# Altium project VCU.PrjPcb (part 3 of 4)

## Sheet 12V_Load_Switches.SchDoc: Title
size A3; Project: Q24 VCU; ENG_APP_DATE: --/--/--; DSN_APP_DATE: --/--/--; CHK_APP_DATE: --/--/--; Date: *******; ApprovedBy: *******; CheckedBy: None; Author: *******; CompanyName: *******; DrawnBy: Jacob Chisholm; Engineer: *******; Organization: *******; Address1: *******; Address2: *******; Address3: *******; Address4: *******; DocumentNumber: 8; Revision: *******; SheetNumber: 8; SheetTotal: 14; Address_Website: https://jchisholm204.github.io; E-Mail: JacobChisholm1010@gmail.com; CurrentTime: *******; CurrentDate: *******; Time: *******; DocumentFullPathAndName: *******; DocumentName: *******; ModifiedDate: *******; ImagePath: *******; ProjectName: *******; Application_BuildNumber: *******
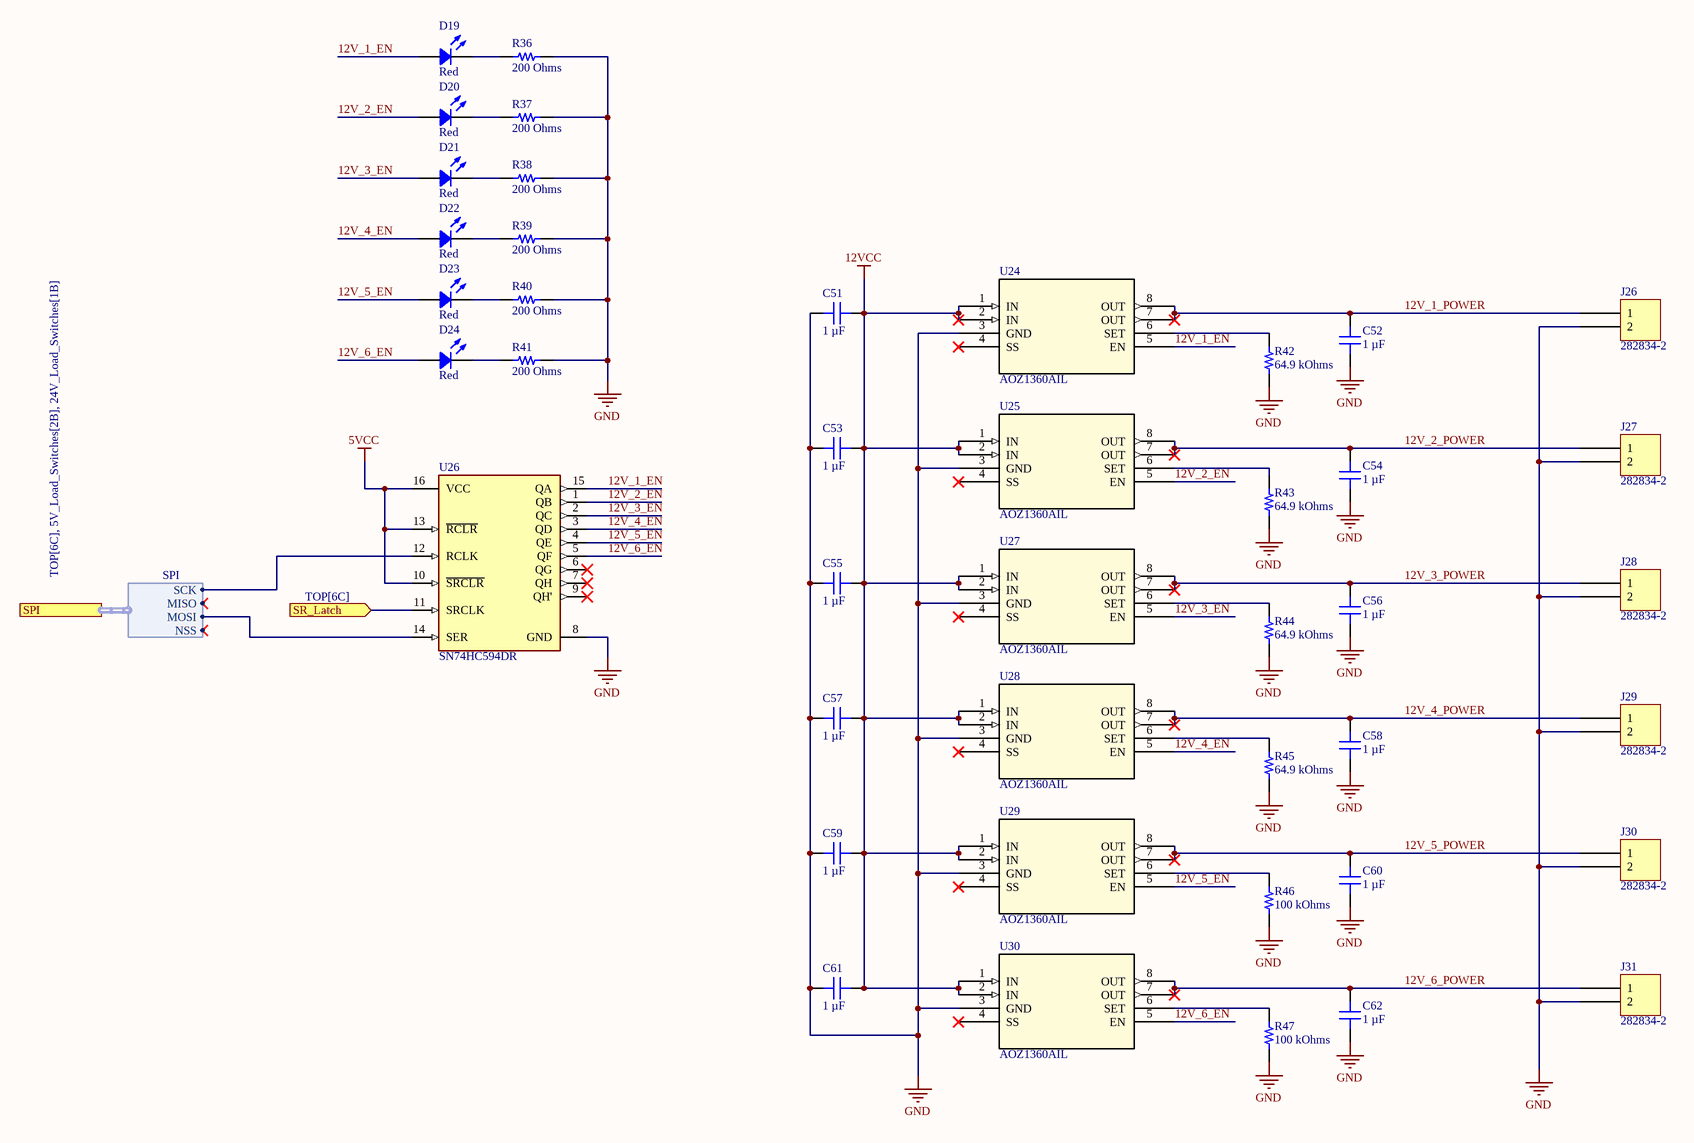
[diagram p8: 12V_Load_Switches.SchDoc]

### Parts
C51  1 µF  [CAP 0805_2012]
C52  1 µF  [CAP 0805_2012]
C53  1 µF  [CAP 0805_2012]
C54  1 µF  [CAP 0805_2012]
C55  1 µF  [CAP 0805_2012]
C56  1 µF  [CAP 0805_2012]
C57  1 µF  [CAP 0805_2012]
C58  1 µF  [CAP 0805_2012]
C59  1 µF  [CAP 0805_2012]
C60  1 µF  [CAP 0805_2012]
C61  1 µF  [CAP 0805_2012]
C62  1 µF  [CAP 0805_2012]
D19  Red  [LED 0603_1608 RED]
D20  Red  [LED 0603_1608 RED]
D21  Red  [LED 0603_1608 RED]
D22  Red  [LED 0603_1608 RED]
D23  Red  [LED 0603_1608 RED]
D24  Red  [LED 0603_1608 RED]
J26  282834-2  [TE 282834-2]
J27  282834-2  [TE 282834-2]
J28  282834-2  [TE 282834-2]
J29  282834-2  [TE 282834-2]
J30  282834-2  [TE 282834-2]
J31  282834-2  [TE 282834-2]
R36  200 Ohms  [RES 0603_1608]
R37  200 Ohms  [RES 0603_1608]
R38  200 Ohms  [RES 0603_1608]
R39  200 Ohms  [RES 0603_1608]
R40  200 Ohms  [RES 0603_1608]
R41  200 Ohms  [RES 0603_1608]
R42  64.9 kOhms  [RES 0603_1608]
R43  64.9 kOhms  [RES 0603_1608]
R44  64.9 kOhms  [RES 0603_1608]
R45  64.9 kOhms  [RES 0603_1608]
R46  100 kOhms  [RES 0603_1608]
R47  100 kOhms  [RES 0603_1608]
U24  AOZ1360AIL  [AOZ1360AIL_AOS]
U25  AOZ1360AIL  [AOZ1360AIL_AOS]
U26  SN74HC594DR  [FP-D0016A-IPC_A]
U27  AOZ1360AIL  [AOZ1360AIL_AOS]
U28  AOZ1360AIL  [AOZ1360AIL_AOS]
U29  AOZ1360AIL  [AOZ1360AIL_AOS]
U30  AOZ1360AIL  [AOZ1360AIL_AOS]

### Ports
SPI (harness SPI, see TOP[6C], 5V_Load_Switches[2B], 24V_Load_Switches[1B]), SR_Latch (in, see TOP[6C])

### Harnesses
SPI: NSS, SCK, MISO, MOSI

### Nets
5VCC: U26.10(~{SRCLR}) U26.13(~{RCLR}) U26.16(VCC)
12VCC: C51.1 C53.1 C55.1 C57.1 C59.1 C61.1 U24.1(IN) U24.2(IN) U25.1(IN) U25.2(IN) U27.1(IN) U27.2(IN) U28.1(IN) U28.2(IN) U29.1(IN) U29.2(IN) U30.1(IN) U30.2(IN)
GND: C51.2 C52.1 C53.2 C54.1 C55.2 C56.1 C57.2 C58.1 C59.2 C60.1 C61.2 C62.1 J26.2 J27.2 J28.2 J29.2 J30.2 J31.2 R36.2 R37.2 R38.2 R39.2 R40.2 R41.2 R42.1 R43.1 R44.1 R45.1 R46.1 R47.1 U24.3(GND) U25.3(GND) U26.8(GND) U27.3(GND) U28.3(GND) U29.3(GND) U30.3(GND)
12V_1_EN: D19.1 U24.5(EN) U26.15(QA)
12V_1_POWER: C52.2 J26.1 U24.7(OUT) U24.8(OUT)
12V_2_EN: D20.1 U25.5(EN) U26.1(QB)
12V_2_POWER: C54.2 J27.1 U25.7(OUT) U25.8(OUT)
12V_3_EN: D21.1 U26.2(QC) U27.5(EN)
12V_3_POWER: C56.2 J28.1 U27.7(OUT) U27.8(OUT)
12V_4_EN: D22.1 U26.3(QD) U28.5(EN)
12V_4_POWER: C58.2 J29.1 U28.7(OUT) U28.8(OUT)
12V_5_EN: D23.1 U26.4(QE) U29.5(EN)
12V_5_POWER: C60.2 J30.1 U29.7(OUT) U29.8(OUT)
12V_6_EN: D24.1 U26.5(QF) U30.5(EN)
12V_6_POWER: C62.2 J31.1 U30.7(OUT) U30.8(OUT)
SPI2_MOSI: U26.14(SER) ; port SPI.MOSI
SPI2_SCK: U26.12(RCLK) ; port SPI.SCK
SR_Latch_12V_LS: U26.11(SRCLK) ; port SR_Latch
NetD19_2: D19.2 R36.1
NetD20_2: D20.2 R37.1
NetD21_2: D21.2 R38.1
NetD22_2: D22.2 R39.1
NetD23_2: D23.2 R40.1
NetD24_2: D24.2 R41.1
NetR42_2: R42.2 U24.6(SET)
NetR43_2: R43.2 U25.6(SET)
NetR44_2: R44.2 U27.6(SET)
NetR45_2: R45.2 U28.6(SET)
NetR46_2: R46.2 U29.6(SET)
NetR47_2: R47.2 U30.6(SET)

Not connected (* = marked no-connect by the designer): U24 4(SS)*; U25 4(SS)*; U26 6(QG)* 7(QH)* 9(QH')*; U27 4(SS)*; U28 4(SS)*; U29 4(SS)*; U30 4(SS)*

### Notes on the sheet
- Title:
- Drawn By:
- Page Contents:
- Checked By:
- Size:
- Date:
- File:
- License:
- Email:
- A3
- Number:
- Time:
- Revision:
- Sheet
- Website:
- of

### Library data of the parts
C51-C62 = GCJ21BR71H105KA01L: as C17 on sheet 24V_Load_Switches; Part Number: GCJ21BR71H105KA01L; Value: 1 µF; Applications: Automotive, Boardflex Sensitive; Capacitance: 1 µF; componentlink1description: Datasheet; componentlink1url: https://www.murata.com/~/media/webrenewal/support/library/catalog/products/capacitor/mlcc/c03e.ashx?la=en-us; componentlink2description: DigiKey Link; componentlink2url: https://www.digikey.com/en/products/detail/murata-electronics/GCJ21BR71H105KA01L/4903512; Device Package: 0805 (2012 Metric); Features: Soft Termination; lastupdated: 12/20/2023 8:14:07 PM; Lifecycle Status: Active; Minimum Order: 1; Mounting Type: Surface Mount, MLCC; Operating Temperature: -55°C ~ 125°C; Package / Case: 0805 (2012 Metric); packaging: TapeAndReel; partid: 2709; Part Status: Active; price: 0.05; Ratings: AEC-Q200; series: GCJ; Size / Dimension: 0.079" L x 0.049" W (2.00mm x 1.25mm); Supplier 1: DigiKey; Supplier Part Number 1: 490-10667-1-ND; Temperature Coefficient: X7R; Thickness (Max): 0.057" (1.45mm); Voltage - Rated: 50V
D19-D24 = 19-213SDRC/S259/TR8: as D1 on sheet 24V_Load_Switches; Part Number: 19-213SDRC/S259/TR8; Color: Red; ComponentLink1Description: Datasheet; ComponentLink1URL: //media.digikey.com/pdf/Data%20Sheets/Everlight%20PDFs/19-213SDRC-S259-TR8.pdf; ComponentLink2Description: DigiKey Link; ComponentLink2URL: http://digikey.com/product-detail/en/everlight-electronics-co-ltd/19-213SDRC-S259-TR8/1080-1580-1-ND/8535303; Device Package: 0603 (1608 Metric); Height (Max): 0.70mm; LastUpdated: 2/2/2024 9:29:56 PM; Lens Transparency: Clear; Lifecycle Status: Active; Minimum Order: 1; Mounting Type: Surface Mount; Package / Case: 0603 (1608 Metric); Packaging: TapeAndReel; PartId: 372; Part Status: Active; Price: 0.06; Series: -; Size / Dimension: 1.60mm L x 0.80mm W; Supplier 1: DigiKey; Supplier Part Number 1: 1080-1580-1-ND; Supplier Device Package: 2-SMD; Value: Red
J26-J31 = 282834-2: as J10 on sheet 24V_Load_Switches; Part Number: 282834-2; Color: Green; ComponentLink1Description: Datasheet; ComponentLink1URL: https://www.te.com/commerce/DocumentDelivery/DDEController?Action=srchrtrv&DocNm=282834&DocType=Customer+Drawing&DocLang=English; ComponentLink2Description: DigiKey Link; ComponentLink2URL: http://digikey.com/product-detail/en/te-connectivity-amp-connectors/282834-2/A98333-ND/1150135; LastUpdated: 1/15/2020 4:15:38 AM; Lifecycle Status: Active; Minimum Order: 1; Mounting Type: Through Hole; Packaging: Bulk; Part Status: Active; Price: 0.88; Series: Buchanan; Supplier 1: DigiKey; Supplier Part Number 1: A98333-ND
R36-R41 = RS73F1JTTD2000B: as R14 on sheet 24V_Load_Switches; Part Number: RS73F1JTTD2000B; Value: 200 Ohms; ComponentLink1Description: Datasheet; ComponentLink1URL: http://www.koaspeer.com/pdfs/RS73.pdf; ComponentLink2Description: DigiKey Link; ComponentLink2URL: https://www.digikey.com/en/products/detail/koa-speer-electronics-inc/RS73F1JTTD2000B/11594419; Composition: Thick Film; Device Package: 0603 (1608 Metric); Features: Automotive AEC-Q200, Moisture Resistant; Height - Seated (Max): 0.022" (0.55mm); LastUpdated: 2/2/2024 8:38:37 PM; Lifecycle Status: Active; Minimum Order: 1; Number of Terminations: 2; Operating Temperature: -55°C ~ 155°C; Package / Case: 0603 (1608 Metric); Packaging: TapeAndReel; PartId: 56369; Part Status: Active; Price: 0.07; Ratings: AEC-Q200; Resistance: 200 Ohms; Series: RS73; Size / Dimension: 0.063" L x 0.031" W (1.60mm x 0.80mm); Supplier 1: DigiKey; Supplier Part Number 1: 2019-RS73F1JTTD2000BCT-ND; Supplier Device Package: 0603; Tolerance: ±0.1%
R42-R45 = 7-2176089-3: RES SMD 64.9K OHM 0.1% 1/6W 0603; Manufacturer: TE Connectivity Passive Product; Power (Watts): 0.167W, 1/6W; Temperature Coefficient: ±25ppm/°C; Part Number: 7-2176089-3; Value: 64.9 kOhms; ComponentLink1Description: Datasheet; ComponentLink1URL: https://www.te.com/commerce/DocumentDelivery/DDEController?Action=srchrtrv&DocNm=1773272&DocType=DS&DocLang=English; ComponentLink2Description: DigiKey Link; ComponentLink2URL: https://www.digikey.com/en/products/detail/te-connectivity-passive-product/7-2176089-3/4033750; Composition: Thin Film; Device Package: 0603 (1608 Metric); Height - Seated (Max): 0.022" (0.55mm); LastUpdated: 12/19/2023 8:39:23 PM; Lifecycle Status: Active; Minimum Order: 1; Number of Terminations: 2; Operating Temperature: -55°C ~ 155°C; Package / Case: 0603 (1608 Metric); Packaging: TapeAndReel; PartId: 23912; Part Status: Active; Price: 0.14; Resistance: 64.9 kOhms; Series: RP73P, Holsworthy; Size / Dimension: 0.061" L x 0.031" W (1.55mm x 0.80mm); Supplier 1: DigiKey; Supplier Part Number 1: A110282CT-ND; Supplier Device Package: 0603; Tolerance: ±0.1%
R46 R47 = AA0603FR-07100KL: RES SMD 100K OHM 1% 1/10W 0603; Manufacturer: Yageo; Power (Watts): 0.1W, 1/10W; Temperature Coefficient: ±150ppm/°C; Part Number: AA0603FR-07100KL; Value: 100 kOhms; ComponentLink1Description: Datasheet; ComponentLink1URL: https://www.yageo.com/upload/media/product/productsearch/datasheet/rchip/PYu-AA_51_RoHS_L_3.pdf; ComponentLink2Description: DigiKey Link; ComponentLink2URL: https://www.digikey.com/en/products/detail/yageo/AA0603FR-07100KL/5888687; Composition: Thick Film; Device Package: 0603 (1608 Metric); Features: Anti-Sulfur, Automotive AEC-Q200, Moisture Resistant; Height - Seated (Max): 0.022" (0.55mm); LastUpdated: 12/20/2023 8:36:28 PM; Lifecycle Status: Active; Minimum Order: 1; Number of Terminations: 2; Operating Temperature: -55°C ~ 155°C; Package / Case: 0603 (1608 Metric); Packaging: TapeAndReel; PartId: 78895; Price: 0.01; Ratings: AEC-Q200; Resistance: 100 kOhms; Series: AA; Size / Dimension: 0.063" L x 0.031" W (1.60mm x 0.80mm); Supplier 1: DigiKey; Supplier Part Number 1: 13-AA0603FR-07100KLCT-ND; Supplier Device Package: 0603; Tolerance: ±1%
U24 U25 U27-U30 = AOZ1360AIL: No Description Available; Mfr_Name: Alpha and Omega Semiconductor; Copyright: Copyright (C) 2023 Ultra Librarian. All rights reserved.; Manufacturer_Part_Number: AOZ1360AIL; RefDes: RefDes; Type: DEV
U26 = CMP-0780-00061-4: as U6 on sheet 24V_Load_Switches; RoHS Compliant: Yes; Width: 3.91mm; Length: 9.9mm; Min Operating Temperature: -40°C; Max Operating Temperature: 125°C; Package Quantity: 2500; Series: 74HC; Height: 1.58mm; Number of Bits: 8; Mount: Surface Mount; Logic Function: Shift Register; Radiation Hardening: No; Number of Pins: 16; Technology: CMOS; Packaging: Tape and Reel; Lead Free: Lead Free; Weight: 0.004998oz; REACH SVHC: No SVHC; Case/Package: SOIC

## Sheet 5V_Load_Switches.SchDoc: Title
size A3; Project: Q24 VCU; ENG_APP_DATE: --/--/--; DSN_APP_DATE: --/--/--; CHK_APP_DATE: --/--/--; Date: *******; ApprovedBy: *******; CheckedBy: None; Author: *******; CompanyName: *******; DrawnBy: Jacob Chisholm; Engineer: *******; Organization: *******; Address1: *******; Address2: *******; Address3: *******; Address4: *******; DocumentNumber: 7; Revision: *******; SheetNumber: 7; SheetTotal: 14; Address_Website: https://jchisholm204.github.io; E-Mail: JacobChisholm1010@gmail.com; CurrentTime: *******; CurrentDate: *******; Time: *******; DocumentFullPathAndName: *******; DocumentName: *******; ModifiedDate: *******; ImagePath: *******; ProjectName: *******; Application_BuildNumber: *******
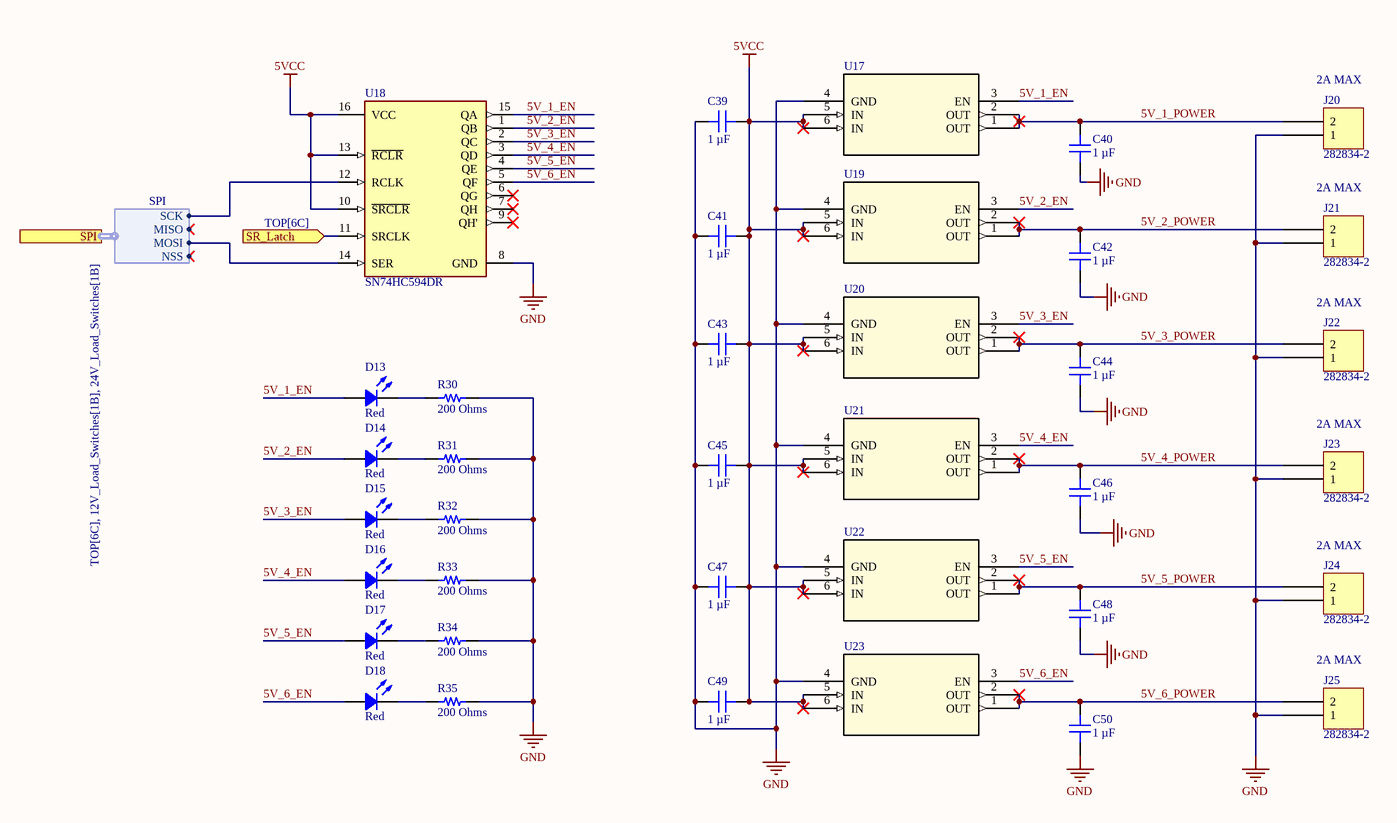
[diagram p9: 5V_Load_Switches.SchDoc]

### Parts
C39  1 µF  [CAP 0805_2012]
C40  1 µF  [CAP 0805_2012]
C41  1 µF  [CAP 0805_2012]
C42  1 µF  [CAP 0805_2012]
C43  1 µF  [CAP 0805_2012]
C44  1 µF  [CAP 0805_2012]
C45  1 µF  [CAP 0805_2012]
C46  1 µF  [CAP 0805_2012]
C47  1 µF  [CAP 0805_2012]
C48  1 µF  [CAP 0805_2012]
C49  1 µF  [CAP 0805_2012]
C50  1 µF  [CAP 0805_2012]
D13  Red  [LED 0603_1608 RED]
D14  Red  [LED 0603_1608 RED]
D15  Red  [LED 0603_1608 RED]
D16  Red  [LED 0603_1608 RED]
D17  Red  [LED 0603_1608 RED]
D18  Red  [LED 0603_1608 RED]
J20  282834-2  [TE 282834-2]
J21  282834-2  [TE 282834-2]
J22  282834-2  [TE 282834-2]
J23  282834-2  [TE 282834-2]
J24  282834-2  [TE 282834-2]
J25  282834-2  [TE 282834-2]
R30  200 Ohms  [RES 0603_1608]
R31  200 Ohms  [RES 0603_1608]
R32  200 Ohms  [RES 0603_1608]
R33  200 Ohms  [RES 0603_1608]
R34  200 Ohms  [RES 0603_1608]
R35  200 Ohms  [RES 0603_1608]
U17  (no value)  [SIP32510DT-T1-GE3_VIS]
U18  SN74HC594DR  [FP-D0016A-IPC_A]
U19  (no value)  [SIP32510DT-T1-GE3_VIS]
U20  (no value)  [SIP32510DT-T1-GE3_VIS]
U21  (no value)  [SIP32510DT-T1-GE3_VIS]
U22  (no value)  [SIP32510DT-T1-GE3_VIS]
U23  (no value)  [SIP32510DT-T1-GE3_VIS]

### Ports
SPI (harness SPI, see TOP[6C], 12V_Load_Switches[1B], 24V_Load_Switches[1B]), SR_Latch (in, see TOP[6C])

### Harnesses
SPI: NSS, SCK, MISO, MOSI

### Nets
5VCC: C39.2 C41.2 C43.2 C45.2 C47.2 C49.2 U17.5(IN) U17.6(IN) U18.10(~{SRCLR}) U18.13(~{RCLR}) U18.16(VCC) U19.5(IN) U19.6(IN) U20.5(IN) U20.6(IN) U21.5(IN) U21.6(IN) U22.5(IN) U22.6(IN) U23.5(IN) U23.6(IN)
GND: C39.1 C40.1 C41.1 C42.1 C43.1 C44.1 C45.1 C46.1 C47.1 C48.1 C49.1 C50.1 J20.1 J21.1 J22.1 J23.1 J24.1 J25.1 R30.2 R31.2 R32.2 R33.2 R34.2 R35.2 U17.4(GND) U18.8(GND) U19.4(GND) U20.4(GND) U21.4(GND) U22.4(GND) U23.4(GND)
5V_1_EN: D13.1 U17.3(EN) U18.15(QA)
5V_1_POWER: C40.2 J20.2 U17.1(OUT) U17.2(OUT)
5V_2_EN: D14.1 U18.1(QB) U19.3(EN)
5V_2_POWER: C42.2 J21.2 U19.1(OUT) U19.2(OUT)
5V_3_EN: D15.1 U18.2(QC) U20.3(EN)
5V_3_POWER: C44.2 J22.2 U20.1(OUT) U20.2(OUT)
5V_4_EN: D16.1 U18.3(QD) U21.3(EN)
5V_4_POWER: C46.2 J23.2 U21.1(OUT) U21.2(OUT)
5V_5_EN: D17.1 U18.4(QE) U22.3(EN)
5V_5_POWER: C48.2 J24.2 U22.1(OUT) U22.2(OUT)
5V_6_EN: D18.1 U18.5(QF) U23.3(EN)
5V_6_POWER: C50.2 J25.2 U23.1(OUT) U23.2(OUT)
SPI2_MOSI: U18.14(SER) ; port SPI.MOSI
SPI2_SCK: U18.12(RCLK) ; port SPI.SCK
SR_Latch_5V_LS: U18.11(SRCLK) ; port SR_Latch
NetD13_2: D13.2 R30.1
NetD14_2: D14.2 R31.1
NetD15_2: D15.2 R32.1
NetD16_2: D16.2 R33.1
NetD17_2: D17.2 R34.1
NetD18_2: D18.2 R35.1

Not connected (* = marked no-connect by the designer): U18 6(QG)* 7(QH)* 9(QH')*

### Notes on the sheet
- (near J20) 2A MAX
- 2A MAX
- (near J23) 2A MAX
- (near J24) 2A MAX
- Title:
- Drawn By:
- Page Contents:
- Checked By:
- Size:
- Date:
- File:
- License:
- Email:
- A3
- Number:
- Time:
- Revision:
- Sheet
- Website:
- of

### Library data of the parts
C39-C48 C50 = 0805B105K500CT: CAP CER 1UF 50V X7R 0805; manufacturer: Walsin Technology Corporation; Tolerance: ±10%; Part Number: 0805B105K500CT; Value: 1 µF; Applications: General Purpose; Capacitance: 1 µF; componentlink1description: Datasheet; componentlink1url: https://www.passivecomponent.com/wp-content/uploads/datasheet/WTC_MLCC_General_Purpose.pdf; componentlink2description: DigiKey Link; componentlink2url: https://www.digikey.com/en/products/detail/walsin-technology-corporation/0805B105K500CT/14836864; Device Package: 0805 (2012 Metric); lastupdated: 12/20/2023 8:12:21 PM; Lifecycle Status: Active; Minimum Order: 1; Mounting Type: Surface Mount, MLCC; Operating Temperature: -55°C ~ 125°C; Package / Case: 0805 (2012 Metric); packaging: TapeAndReel; partid: 41252; Part Status: Active; price: 0.05; series: -; Size / Dimension: 0.079" L x 0.049" W (2.00mm x 1.25mm); Supplier 1: DigiKey; Supplier Part Number 1: 1292-0805B105K500CT-ND; Temperature Coefficient: X7R; Thickness (Max): 0.057" (1.45mm); Voltage - Rated: 50V
C49 = 08051Z105KAT2A: 0805 X7S 1UF10% 100V; manufacturer: KYOCERA AVX; Tolerance: ±10%; Part Number: 08051Z105KAT2A; Value: 1 µF; Applications: General Purpose; Capacitance: 1 µF; componentlink1description: Datasheet; componentlink1url: https://datasheets.kyocera-avx.com/X7S.pdf; componentlink2description: DigiKey Link; componentlink2url: https://www.digikey.com/en/products/detail/kyocera-avx/08051Z105KAT2A/17866368; Device Package: 0805 (2012 Metric); lastupdated: 2/1/2024 8:13:20 PM; Lifecycle Status: Active; Minimum Order: 1; Mounting Type: Surface Mount, MLCC; Operating Temperature: -55°C ~ 125°C; Package / Case: 0805 (2012 Metric); packaging: TapeAndReel; partid: 54857; Part Status: Active; price: 0.08; series: -; Size / Dimension: 0.079" L x 0.049" W (2.01mm x 1.25mm); Supplier 1: DigiKey; Supplier Part Number 1: 478-08051Z105KAT2ACT-ND; Temperature Coefficient: X7S; Voltage - Rated: 100V
D13-D18 = 19-213SDRC/S259/TR8: LED RED CLEAR 2SMD; Manufacturer: Everlight Electronics Co Ltd; Configuration: Standard; Current - Test: 10mA; Lens Color: Colorless; Lens Size: 1.20mm x 0.80mm; Lens Style: Rectangle with Flat Top; Viewing Angle: 120°; Voltage - Forward (Vf) (Typ): 2V; Wavelength - Peak: 650nm; Part Number: 19-213SDRC/S259/TR8; Color: Red; ComponentLink1Description: Datasheet; ComponentLink1URL: //media.digikey.com/pdf/Data%20Sheets/Everlight%20PDFs/19-213SDRC-S259-TR8.pdf; ComponentLink2Description: DigiKey Link; ComponentLink2URL: http://digikey.com/product-detail/en/everlight-electronics-co-ltd/19-213SDRC-S259-TR8/1080-1580-1-ND/8535303; Device Package: 0603 (1608 Metric); Height (Max): 0.70mm; LastUpdated: 2/2/2024 9:29:56 PM; Lens Transparency: Clear; Lifecycle Status: Active; Minimum Order: 1; Mounting Type: Surface Mount; Package / Case: 0603 (1608 Metric); Packaging: TapeAndReel; PartId: 372; Part Status: Active; Price: 0.06; Series: -; Size / Dimension: 1.60mm L x 0.80mm W; Supplier 1: DigiKey; Supplier Part Number 1: 1080-1580-1-ND; Supplier Device Package: 2-SMD; Value: Red
J20-J25 = 282834-2: TERM BLK 2P SIDE ENT 2.54MM PCB; Manufacturer: TE Connectivity AMP Connectors; Current: 10A; Mating Orientation: Horizontal with Board; Number of Levels: 1; Pitch: 0.100" (2.54mm); Positions Per Level: 2; Voltage: 150V; Wire Gauge: 16-30 AWG; Wire Termination: Screw - Rising Cage Clamp; Part Number: 282834-2; Color: Green; ComponentLink1Description: Datasheet; ComponentLink1URL: https://www.te.com/commerce/DocumentDelivery/DDEController?Action=srchrtrv&DocNm=282834&DocType=Customer+Drawing&DocLang=English; ComponentLink2Description: DigiKey Link; ComponentLink2URL: http://digikey.com/product-detail/en/te-connectivity-amp-connectors/282834-2/A98333-ND/1150135; LastUpdated: 1/15/2020 4:15:38 AM; Lifecycle Status: Active; Minimum Order: 1; Mounting Type: Through Hole; Packaging: Bulk; Part Status: Active; Price: 0.88; Series: Buchanan; Supplier 1: DigiKey; Supplier Part Number 1: A98333-ND
R30-R35 = RS73F1JTTD2000B: RES 200 OHM 0.1% 1/5W 0603; Manufacturer: KOA Speer Electronics, Inc.; Power (Watts): 0.2W, 1/5W; Temperature Coefficient: ±25ppm/°C; Part Number: RS73F1JTTD2000B; Value: 200 Ohms; ComponentLink1Description: Datasheet; ComponentLink1URL: http://www.koaspeer.com/pdfs/RS73.pdf; ComponentLink2Description: DigiKey Link; ComponentLink2URL: https://www.digikey.com/en/products/detail/koa-speer-electronics-inc/RS73F1JTTD2000B/11594419; Composition: Thick Film; Device Package: 0603 (1608 Metric); Features: Automotive AEC-Q200, Moisture Resistant; Height - Seated (Max): 0.022" (0.55mm); LastUpdated: 2/2/2024 8:38:37 PM; Lifecycle Status: Active; Minimum Order: 1; Number of Terminations: 2; Operating Temperature: -55°C ~ 155°C; Package / Case: 0603 (1608 Metric); Packaging: TapeAndReel; PartId: 56369; Part Status: Active; Price: 0.07; Ratings: AEC-Q200; Resistance: 200 Ohms; Series: RS73; Size / Dimension: 0.063" L x 0.031" W (1.60mm x 0.80mm); Supplier 1: DigiKey; Supplier Part Number 1: 2019-RS73F1JTTD2000BCT-ND; Supplier Device Package: 0603; Tolerance: ±0.1%
U17 U19-U23 = SIP32510DT-T1-GE3: No Description Available; Mfr_Name: Vishay; Copyright: Copyright (C) 2023 Ultra Librarian. All rights reserved.; Manufacturer_Part_Number: SIP32510DT-T1-GE3; RefDes: RefDes; Type: DEV
U18 = CMP-0780-00061-4: IC SHIFT REGISTER 8BIT 16-SOIC; Number of Bits per Element: 8; Min Supply Voltage: 2V; Frequency: 40MHz; Max Supply Voltage: 6V; Operating Supply Voltage: 5V; Number of Output Lines: 10; Propagation Delay: 25ns; Number of Elements: 1; Number of Circuits: 4; Direction: Unidirectional; Turn-On Delay Time: 185ns; RoHS Compliant: Yes; Width: 3.91mm; Length: 9.9mm; Min Operating Temperature: -40°C; Max Operating Temperature: 125°C; Package Quantity: 2500; Series: 74HC; Height: 1.58mm; Number of Bits: 8; Mount: Surface Mount; Logic Function: Shift Register; Radiation Hardening: No; Number of Pins: 16; Technology: CMOS; Packaging: Tape and Reel; Lead Free: Lead Free; Weight: 0.004998oz; REACH SVHC: No SVHC; Case/Package: SOIC

## Sheet 24V_FETS.SchDoc: Title
size A4; Project: Q24 VCU; ENG_APP_DATE: --/--/--; DSN_APP_DATE: --/--/--; CHK_APP_DATE: --/--/--; Date: *******; ApprovedBy: *******; CheckedBy: None; Author: *******; CompanyName: *******; DrawnBy: Jacob Chisholm; Engineer: *******; Organization: *******; Address1: *******; Address2: *******; Address3: *******; Address4: *******; DocumentNumber: 6; Revision: *******; SheetNumber: 6; SheetTotal: 14; Address_Website: https://jchisholm204.github.io; E-Mail: JacobChisholm1010@gmail.com; CurrentTime: *******; CurrentDate: *******; Time: *******; DocumentFullPathAndName: *******; DocumentName: *******; ModifiedDate: *******; ImagePath: *******; ProjectName: *******; Application_BuildNumber: *******
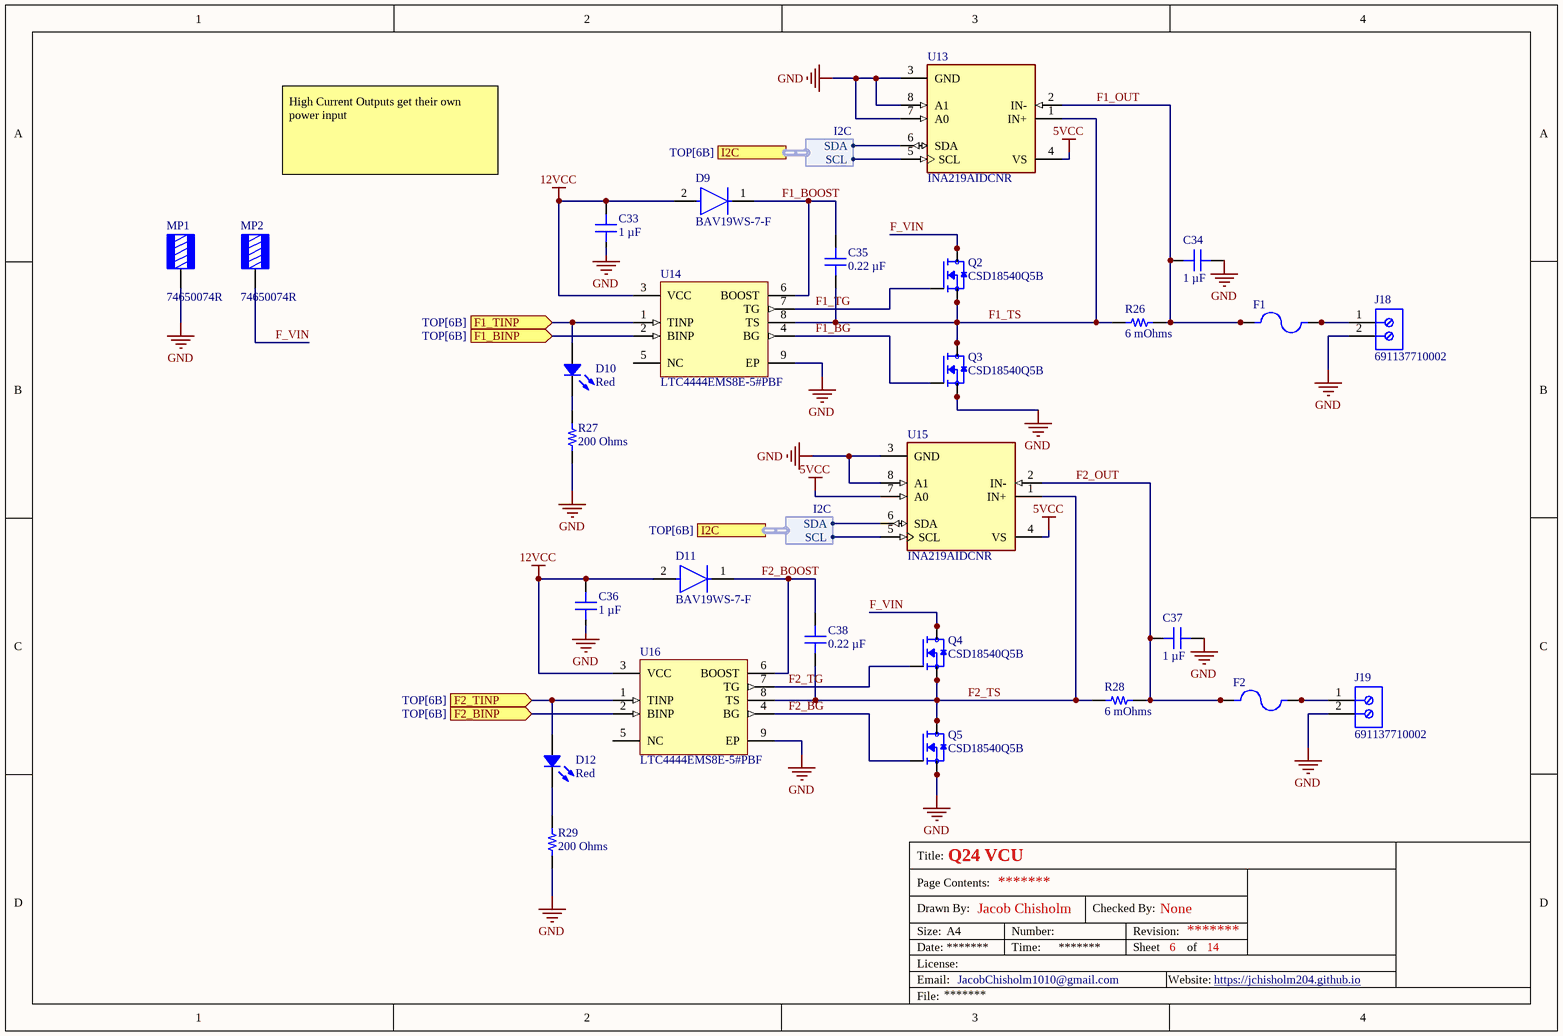
[diagram p10: 24V_FETS.SchDoc]

### Parts
C33  1 µF  [CAP 0603_1608]
C34  1 µF  [CAP 0805_2012]
C35  0.22 µF  [CAP 0603_1608]
C36  1 µF  [CAP 0603_1608]
C37  1 µF  [CAP 0805_2012]
C38  0.22 µF  [CAP 0603_1608]
D9  BAV19WS-7-F  [FP-SOD323-MFG]
D10  Red  [LED 0603_1608 RED]
D11  BAV19WS-7-F  [FP-SOD323-MFG]
D12  Red  [LED 0603_1608 RED]
F1  (no value)  [FUSE_3587-10TR]
F2  (no value)  [FUSE_3587-10TR]
J18  691137710002  [691137710002]
J19  691137710002  [691137710002]
MP1  74650074R  [WURTH 74650074]
MP2  74650074R  [WURTH 74650074]
Q2  CSD18540Q5B  [TRANS_CSD18540Q5B]
Q3  CSD18540Q5B  [TRANS_CSD18540Q5B]
Q4  CSD18540Q5B  [TRANS_CSD18540Q5B]
Q5  CSD18540Q5B  [TRANS_CSD18540Q5B]
R26  6 mOhms  [RES 0805_2012]
R27  200 Ohms  [RES 0603_1608]
R28  6 mOhms  [RES 0805_2012]
R29  200 Ohms  [RES 0603_1608]
U13  INA219AIDCNR  [FP-DCN0008A-IPC_B]
U14  LTC4444EMS8E-5#PBF  [LT-MS8E-8-EDP_L]
U15  INA219AIDCNR  [FP-DCN0008A-IPC_B]
U16  LTC4444EMS8E-5#PBF  [LT-MS8E-8-EDP_L]

### Ports
F1_BINP (in, see TOP[6B]), F1_TINP (in, see TOP[6B]), F2_BINP (in, see TOP[6B]), F2_TINP (in, see TOP[6B]), I2C (harness I2C, see TOP[6B])

### Harnesses
I2C: SDA, SCL

### Nets
5VCC: U13.4(VS) U15.4(VS) U15.7(A0)
12VCC: C33.2 C36.2 D9.2(A) D11.2(A) U14.3(VCC) U16.3(VCC)
GND: C33.1 C34.1 C36.1 C37.1 J18.2 J19.2 MP1.1 Q3.1(S) Q3.2(S) Q3.3(S) Q5.1(S) Q5.2(S) Q5.3(S) R27.2 R29.2 U13.3(GND) U13.7(A0) U13.8(A1) U14.9(EP) U15.3(GND) U15.8(A1) U16.9(EP)
F1_BG: Q3.4(G) U14.4(BG)
F1_BOOST: C35.2 D9.1(C) U14.6(BOOST)
F1_HIGH: D10.1 U14.1(TINP) ; port F1_TINP
F1_LOW: U14.2(BINP) ; port F1_BINP
F1_OUT: C34.2 F1.1_1 F1.1_2 R26.2 U13.2(IN-)
F1_TG: Q2.4(G) U14.7(TG)
F1_TS: C35.1 Q2.1(S) Q2.2(S) Q2.3(S) Q3.5(D) Q3.6(D) Q3.7(D) Q3.8(D) R26.1 U13.1(IN+) U14.8(TS)
F2_BG: Q5.4(G) U16.4(BG)
F2_BOOST: C38.2 D11.1(C) U16.6(BOOST)
F2_HIGH: D12.1 U16.1(TINP) ; port F2_TINP
F2_LOW: U16.2(BINP) ; port F2_BINP
F2_OUT: C37.2 F2.1_1 F2.1_2 R28.2 U15.2(IN-)
F2_TG: Q4.4(G) U16.7(TG)
F2_TS: C38.1 Q4.1(S) Q4.2(S) Q4.3(S) Q5.5(D) Q5.6(D) Q5.7(D) Q5.8(D) R28.1 U15.1(IN+) U16.8(TS)
F_VIN: MP2.1 Q2.5(D) Q2.6(D) Q2.7(D) Q2.8(D) Q4.5(D) Q4.6(D) Q4.7(D) Q4.8(D)
I2C3_SCL: U13.5(SCL) U15.5(SCL) ; port I2C.SCL
I2C3_SDA: U13.6(SDA) U15.6(SDA) ; port I2C.SDA
NetD10_2: D10.2 R27.1
NetD12_2: D12.2 R29.1
NetF1_2_1: F1.2_1 F1.2_2 J18.1
NetF2_2_1: F2.2_1 F2.2_2 J19.1

Not connected (* = marked no-connect by the designer): U14 5(NC); U16 5(NC)

### Notes on the sheet
- High Current Outputs get their own power input
- Title:
- Drawn By:
- Page Contents:
- Checked By:
- Size:
- Date:
- File:
- License:
- Email:
- A4
- Number:
- Time:
- Revision:
- Sheet
- Website:
- of

### Library data of the parts
C33 C36 = 0603DC105KAT2A: CAP CER 1UF 35V X7R 0603; manufacturer: KYOCERA AVX; Tolerance: ±10%; Part Number: 0603DC105KAT2A; Value: 1 µF; Applications: General Purpose; Capacitance: 1 µF; componentlink1description: Datasheet; componentlink1url: https://media.digikey.com/pdf/Data%20Sheets/AVX%20PDFs/0603DC105KAT2A_DS.pdf; componentlink2description: DigiKey Link; componentlink2url: https://www.digikey.com/en/products/detail/kyocera-avx/0603DC105KAT2A/11208437; Device Package: 0603 (1608 Metric); lastupdated: 2/9/2024 8:09:59 PM; Lifecycle Status: Active; Minimum Order: 1; Mounting Type: Surface Mount, MLCC; Operating Temperature: -55°C ~ 125°C; Package / Case: 0603 (1608 Metric); packaging: TapeAndReel; partid: 35801; Part Status: Active; price: 0.04; series: -; Size / Dimension: 0.063" L x 0.032" W (1.60mm x 0.81mm); Supplier 1: DigiKey; Supplier Part Number 1: 478-0603DC105KAT2ACT-ND; Temperature Coefficient: X7R; Voltage - Rated: 35V
C34 C37 = GCJ21BR71H105KA01L: CAP CER 1UF 50V X7R 0805; manufacturer: Murata Electronics; Tolerance: ±10%; Part Number: GCJ21BR71H105KA01L; Value: 1 µF; Applications: Automotive, Boardflex Sensitive; Capacitance: 1 µF; componentlink1description: Datasheet; componentlink1url: https://www.murata.com/~/media/webrenewal/support/library/catalog/products/capacitor/mlcc/c03e.ashx?la=en-us; componentlink2description: DigiKey Link; componentlink2url: https://www.digikey.com/en/products/detail/murata-electronics/GCJ21BR71H105KA01L/4903512; Device Package: 0805 (2012 Metric); Features: Soft Termination; lastupdated: 12/20/2023 8:14:07 PM; Lifecycle Status: Active; Minimum Order: 1; Mounting Type: Surface Mount, MLCC; Operating Temperature: -55°C ~ 125°C; Package / Case: 0805 (2012 Metric); packaging: TapeAndReel; partid: 2709; Part Status: Active; price: 0.05; Ratings: AEC-Q200; series: GCJ; Size / Dimension: 0.079" L x 0.049" W (2.00mm x 1.25mm); Supplier 1: DigiKey; Supplier Part Number 1: 490-10667-1-ND; Temperature Coefficient: X7R; Thickness (Max): 0.057" (1.45mm); Voltage - Rated: 50V
C35 C38 = 0603B224K160CT: CAP CER 0.22UF 16V X7R 0603; manufacturer: Walsin Technology Corporation; Tolerance: ±10%; Part Number: 0603B224K160CT; Value: 0.22 µF; Applications: General Purpose; Capacitance: 0.22 µF; componentlink1description: Datasheet; componentlink1url: http://www.passivecomponent.com/wp-content/uploads/2018/10/MLCC.pdf; componentlink2description: DigiKey Link; componentlink2url: https://www.digikey.com/en/products/detail/walsin-technology-corporation/0603B224K160CT/9354916; Device Package: 0603 (1608 Metric); lastupdated: 2/9/2024 8:10:20 PM; Lifecycle Status: Active; Minimum Order: 1; Mounting Type: Surface Mount, MLCC; Operating Temperature: -55°C ~ 125°C; Package / Case: 0603 (1608 Metric); packaging: TapeAndReel; partid: 9838; Part Status: Active; price: 0.01; series: -; Size / Dimension: 0.063" L x 0.031" W (1.60mm x 0.80mm); Supplier 1: DigiKey; Supplier Part Number 1: 1292-1419-1-ND; Temperature Coefficient: X7R; Thickness (Max): 0.034" (0.87mm); Voltage - Rated: 16V
D9 D11 = CMP-12791-000007-1: DIODE GEN PURP 100V 200MA SOD323; Manufacturer: Diodes Inc.; Max Surge Forward Current: 1.7A; Max Repetitive Reverse Voltage: 120V; Value: 5pF; Forward Current: 250mA; Standoff Height: 0.05mm; Automotive Grade: Grade 0; Max Junction Temp: +150°C; Peak Reverse Current: 0.1uA; Temperature Range Low: -65°C; ComponentLink2Description: Datasheet; Temperature Range High: +150°C; Device Class L1: Discrete Semiconductors; Octopart: https://octopart.com/bav19ws-7-f-diodes+inc.-55426588; ComponentLink2URL: https://www.diodes.com/assets/Datasheets/ds30119.pdf; Temperature: -65°C to +150°C; Reverse Voltage: 100V; Capacitance: 5pF; Automotive: Yes; Footprint Url: https://www.diodes.com/assets/Package-Files/SOD323.pdf; Lead Free: Yes; Package: SOD323; Digikey Description: DIODE GEN PURP 100V 200MA SOD323; Mouser Description: Diodes - General Purpose, Power, Switching 100V 200mW; Height: 1.1mm; Device Class L2: Diodes; Manufacturer Part Number: BAV19WS-7-F; Category: Diode; RoHS: TRUE; Device Class L3: Rectifier Diodes
D10 D12 = 19-213SDRC/S259/TR8: as D13-D18 on sheet 5V_Load_Switches; Part Number: 19-213SDRC/S259/TR8; Color: Red; ComponentLink1Description: Datasheet; ComponentLink1URL: //media.digikey.com/pdf/Data%20Sheets/Everlight%20PDFs/19-213SDRC-S259-TR8.pdf; ComponentLink2Description: DigiKey Link; ComponentLink2URL: http://digikey.com/product-detail/en/everlight-electronics-co-ltd/19-213SDRC-S259-TR8/1080-1580-1-ND/8535303; Device Package: 0603 (1608 Metric); Height (Max): 0.70mm; LastUpdated: 2/2/2024 9:29:56 PM; Lens Transparency: Clear; Lifecycle Status: Active; Minimum Order: 1; Mounting Type: Surface Mount; Package / Case: 0603 (1608 Metric); Packaging: TapeAndReel; PartId: 372; Part Status: Active; Price: 0.06; Series: -; Size / Dimension: 1.60mm L x 0.80mm W; Supplier 1: DigiKey; Supplier Part Number 1: 1080-1580-1-ND; Supplier Device Package: 2-SMD; Value: Red
F1 F2 = 3587-10TR: MP: 3587-10TR; Price: None; Value: *; Availability: Unavailable; Package: None
J18 J19 = CMP-1502-03324-2: NexarPartId: 78871135; Voltage Rating: 300V; Number of Contacts: 2; Current Rating: 16A; Lead Pitch: 5mm; Height: 11.6mm; Packaging: Box; RoHS: Non-Compliant; Contact Material: Nickel, Tin; Max Operating Temperature: 120°C; Number of Pins: 2; Min Operating Temperature: -30°C; Number of Rows: 1
MP1 MP2 = 74650074R: TERM REDCUBE M4 4PIN PCB; Manufacturer: Würth Elektronik; Current Rating (Amps): 50 A; Part Number: 74650074R; ComponentLink1Description: Datasheet; ComponentLink1URL: https://katalog.we-online.de/em/datasheet/74650074R.pdf; ComponentLink2Description: DigiKey Link; ComponentLink2URL: https://www.digikey.com/en/products/detail/würth-elektronik/74650074R/6643979; Features: Screw not Included; LastUpdated: 8/7/2022 8:40:07 PM; Lifecycle Status: Active; Minimum Order: 1; Mounting Type: Through Hole; Number of Pins: 4; Packaging: TapeAndReel; Part Status: Active; Price: 2.38; Screw Size: M4; Series: REDCUBE WP-THRBU; Supplier 1: DigiKey; Supplier Part Number 1: 732-10883-1-ND; Terminal Type: Screw Terminal, Power Tap; Termination: Solder
Q2-Q5 = CSD18540Q5B: 60-V, N channel NexFETâ„¢ power MOSFET, single SON 5 mm x 6 mm, 2.2 mOhm; MF: Texas Instruments; SnapEDA_Link: https://www.snapeda.com/parts/CSD18540Q5B/Texas+Instruments/view-part/?ref=snap; Purchase-URL: https://pricing.snapeda.com/search/part/CSD18540Q5B/?ref=eda; Package: VSON-CLIP-8 Texas Instruments; MP: CSD18540Q5B; Price: None; Availability: In Stock; Check_prices: https://www.snapeda.com/parts/CSD18540Q5B/Texas+Instruments/view-part/?ref=eda; Value: *
R26 R28 = TLR2ATTD6L00F: RES 0.006 OHM 1% 1W 0805; Manufacturer: KOA Speer Electronics, Inc.; Temperature Coefficient: ±100ppm/°C; Part Number: TLR2ATTD6L00F; Value: 6 mOhms; ComponentLink1Description: Datasheet; ComponentLink1URL: http://www.koaspeer.com/catimages/Products/TLR1E-2A/TLR1E-2A.pdf; ComponentLink2Description: DigiKey Link; ComponentLink2URL: https://www.digikey.com/en/products/detail/koa-speer-electronics-inc/TLR2ATTD6L00F/9845498; Composition: Metal Element; Device Package: 0805 (2012 Metric); Features: Automotive AEC-Q200, Current Sense; Height - Seated (Max): 0.018" (0.45mm); LastUpdated: 1/24/2024 8:59:35 PM; Lifecycle Status: Active; Minimum Order: 1; Number of Terminations: 2; Operating Temperature: -65°C ~ 155°C; Package / Case: 0805 (2012 Metric); Packaging: TapeAndReel; PartId: 42677; Part Status: Active; Power (Watts): 1W; Price: 0.21; Ratings: AEC-Q200; Resistance: 6 mOhms; Series: TLR; Size / Dimension: 0.079" L x 0.049" W (2.00mm x 1.25mm); Supplier 1: DigiKey; Supplier Part Number 1: 2019-TLR2ATTD6L00FCT-ND; Supplier Device Package: 0805; Tolerance: ±1%
R27 R29 = RS73F1JTTD2000B: as R30-R35 on sheet 5V_Load_Switches; Part Number: RS73F1JTTD2000B; Value: 200 Ohms; ComponentLink1Description: Datasheet; ComponentLink1URL: http://www.koaspeer.com/pdfs/RS73.pdf; ComponentLink2Description: DigiKey Link; ComponentLink2URL: https://www.digikey.com/en/products/detail/koa-speer-electronics-inc/RS73F1JTTD2000B/11594419; Composition: Thick Film; Device Package: 0603 (1608 Metric); Features: Automotive AEC-Q200, Moisture Resistant; Height - Seated (Max): 0.022" (0.55mm); LastUpdated: 2/2/2024 8:38:37 PM; Lifecycle Status: Active; Minimum Order: 1; Number of Terminations: 2; Operating Temperature: -55°C ~ 155°C; Package / Case: 0603 (1608 Metric); Packaging: TapeAndReel; PartId: 56369; Part Status: Active; Price: 0.07; Ratings: AEC-Q200; Resistance: 200 Ohms; Series: RS73; Size / Dimension: 0.063" L x 0.031" W (1.60mm x 0.80mm); Supplier 1: DigiKey; Supplier Part Number 1: 2019-RS73F1JTTD2000BCT-ND; Supplier Device Package: 0603; Tolerance: ±0.1%
U13 U15 = CMP-0704-00041-3: IC CURRENT MONITOR 1% SOT23-8; Common Mode Rejection Ratio: 100dB; Bandwidth: 3.4MHz; Operating Supply Current: 1mA; Nominal Supply Current: 700uA; Min Input Voltage: 0V; Output Current per Channel: 10mA; Number of Amplifiers: 1; Input Offset Voltage (Vos): 100uV; Max Input Voltage: 26V; Min Supply Voltage: 3V; Max Supply Current: 5mA; Max Supply Voltage: 5.5V; Output Type: Digital; Accuracy: 1%; Radiation Hardening: No; Min Operating Temperature: -40°C; Contact Plating: Gold; REACH SVHC: No SVHC; Packaging: Tape and Reel; Max Operating Temperature: 125°C; Lead Free: Lead Free; Weight: 0.001411oz; Supply Current: 700uA; Number of Pins: 8; Length: 3mm; Quiescent Current: 700uA; Features: I²C; Height: 1.3mm; Output Current: 10mA; Case/Package: SOT-23-8; RoHS Compliant: Yes; Width: 1.75mm; Package Quantity: 3000; Series: Zero-Drift
U14 U16 = CMP-0479-00254-1: High Voltage Synchronous N-Channel MOSFET Driver, 114 V Vin MAX, 8-pin SOP (MS8E-8-EDP), -40 to 125 degC, Pb-Free; Manufacturer: Linear Technology; PackageReference: MS8E-8; ComponentLink2Description: Datasheet; DatasheetVersion: Rev. C; ComponentLink3Description: Package Specification; PartNumber: LTC4444EMS8E-5#PBF; ComponentLink3URL: http://cds.linear.com/docs/en/packaging/05081662_K_MS8E.pdf; PackageVersion: Rev. J, 10/2011; ComponentLink1URL: http://www.linear.com/; ComponentLink1Description: Manufacturer URL; Mounting Technology: Surface Mount; ComponentLink2URL: http://cds.linear.com/docs/en/datasheet/44445fc.pdf; PackageDescription: 8-Pin Plastic MSOP, Body 3.00 x 3.00 mm. Pitch 0.65 mm; RoHS: TRUE

## Sheet Indicators.SchDoc: Title
size A4; Project: Q24 VCU; ENG_APP_DATE: --/--/--; DSN_APP_DATE: --/--/--; CHK_APP_DATE: --/--/--; Date: *******; ApprovedBy: *******; CheckedBy: None; Author: *******; CompanyName: *******; DrawnBy: Jacob Chisholm; Engineer: *******; Organization: *******; Address1: *******; Address2: *******; Address3: *******; Address4: *******; DocumentNumber: 12; Revision: *******; SheetNumber: 12; SheetTotal: 14; Address_Website: https://jchisholm204.github.io; E-Mail: JacobChisholm1010@gmail.com; CurrentTime: *******; CurrentDate: *******; Time: *******; DocumentFullPathAndName: *******; DocumentName: *******; ModifiedDate: *******; ImagePath: *******; ProjectName: *******; Application_BuildNumber: *******
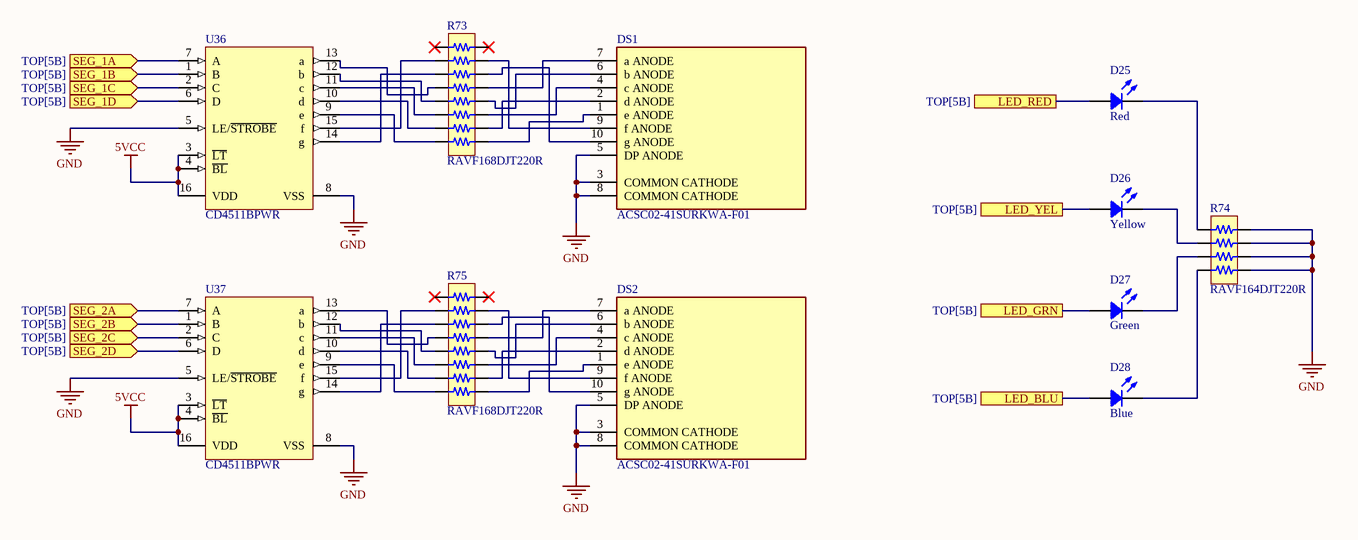
[diagram p11: Indicators.SchDoc]

### Parts
D25  Red  [LED 0805_2012 RED]
D26  Yellow  [LED 0805_2012 YELLOW]
D27  Green  [LED 0805_2012 GREEN]
D28  Blue  [LED 0805_2012 BLUE]
DS1  ACSC02-41SURKWA-F01  [FP-ACSC02-41SURKWA-F01-MFG]
DS2  ACSC02-41SURKWA-F01  [FP-ACSC02-41SURKWA-F01-MFG]
R73  RAVF168DJT220R  [RESNET 1506-16 CONVEX]
R74  RAVF164DJT220R  [RESNET 1206-8 CONVEX]
R75  RAVF168DJT220R  [RESNET 1506-16 CONVEX]
U36  CD4511BPWR  [PW0016A_N]
U37  CD4511BPWR  [PW0016A_N]

### Ports
LED_BLU (see TOP[5B]), LED_GRN (see TOP[5B]), LED_RED (see TOP[5B]), LED_YEL (see TOP[5B]), SEG_1A (in, see TOP[5B]), SEG_1B (in, see TOP[5B]), SEG_1C (in, see TOP[5B]), SEG_1D (in, see TOP[5B]), SEG_2A (in, see TOP[5B]), SEG_2B (in, see TOP[5B]), SEG_2C (in, see TOP[5B]), SEG_2D (in, see TOP[5B])

### Nets
5VCC: U36.3(~{LT}) U36.4(~{BL}) U36.16(VDD) U37.3(~{LT}) U37.4(~{BL}) U37.16(VDD)
GND: DS1.3(COMMON_CATHODE) DS1.5(DP_ANODE) DS1.8(COMMON_CATHODE) DS2.3(COMMON_CATHODE) DS2.5(DP_ANODE) DS2.8(COMMON_CATHODE) R74.5 R74.6 R74.7 R74.8 U36.5(LE/~{STROBE}) U36.8(VSS) U37.5(LE/~{STROBE}) U37.8(VSS)
Indicator_LED_BLU: D28.1 ; port LED_BLU
Indicator_LED_GRN: D27.1 ; port LED_GRN
Indicator_LED_RED: D25.1 ; port LED_RED
Indicator_LED_YEL: D26.1 ; port LED_YEL
Indicator_SEG1A: U36.7(A) ; port SEG_1A
Indicator_SEG1B: U36.1(B) ; port SEG_1B
Indicator_SEG1C: U36.2(C) ; port SEG_1C
Indicator_SEG1D: U36.6(D) ; port SEG_1D
Indicator_SEG2A: U37.7(A) ; port SEG_2A
Indicator_SEG2B: U37.1(B) ; port SEG_2B
Indicator_SEG2C: U37.2(C) ; port SEG_2C
Indicator_SEG2D: U37.6(D) ; port SEG_2D
NetD25_2: D25.2 R74.1
NetD26_2: D26.2 R74.2
NetD27_2: D27.2 R74.3
NetD28_2: D28.2 R74.4
NetDS1_1: DS1.1(e_ANODE) R73.9
NetDS1_2: DS1.2(d_ANODE) R73.10
NetDS1_4: DS1.4(c_ANODE) R73.11
NetDS1_6: DS1.6(b_ANODE) R73.12
NetDS1_7: DS1.7(a_ANODE) R73.13
NetDS1_9: DS1.9(f_ANODE) R73.15
NetDS1_10: DS1.10(g_ANODE) R73.14
NetDS2_1: DS2.1(e_ANODE) R75.9
NetDS2_2: DS2.2(d_ANODE) R75.10
NetDS2_4: DS2.4(c_ANODE) R75.11
NetDS2_6: DS2.6(b_ANODE) R75.12
NetDS2_7: DS2.7(a_ANODE) R75.13
NetDS2_9: DS2.9(f_ANODE) R75.15
NetDS2_10: DS2.10(g_ANODE) R75.14
NetR73_2: R73.2 U36.15(f)
NetR73_3: R73.3 U36.14(g)
NetR73_4: R73.4 U36.13(a)
NetR73_5: R73.5 U36.12(b)
NetR73_6: R73.6 U36.11(c)
NetR73_7: R73.7 U36.10(d)
NetR73_8: R73.8 U36.9(e)
NetR75_2: R75.2 U37.15(f)
NetR75_3: R75.3 U37.14(g)
NetR75_4: R75.4 U37.13(a)
NetR75_5: R75.5 U37.12(b)
NetR75_6: R75.6 U37.11(c)
NetR75_7: R75.7 U37.10(d)
NetR75_8: R75.8 U37.9(e)

Not connected (* = marked no-connect by the designer): R73 1* 16*; R75 1* 16*

### Notes on the sheet
- Title:
- Drawn By:
- Page Contents:
- Checked By:
- Size:
- Date:
- File:
- License:
- Email:
- A4
- Number:
- Time:
- Revision:
- Sheet
- Website:
- of

### Library data of the parts
D25 = SM0805URC: LED RED CLEAR 0805 SMD; Manufacturer: Bivar Inc.; Configuration: Standard; Current - Test: 20mA; Lens Color: Colorless; Lens Size: 1.40mm x 1.20mm; Lens Style: Rectangle with Flat Top; Millicandela Rating: 55mcd; Viewing Angle: 130°; Voltage - Forward (Vf) (Typ): 2.1V; Wavelength - Dominant: 640nm; Wavelength - Peak: 655nm; Part Number: SM0805URC; Color: Red; ComponentLink1Description: Datasheet; ComponentLink1URL: https://www.bivar.com/Files/Datasheets/SM0805URC.pdf; ComponentLink2Description: DigiKey Link; ComponentLink2URL: https://www.digikey.com/en/products/detail/bivar-inc/SM0805URC/528906; Device Package: 0805 (2012 Metric); Height (Max): 1.10mm; LastUpdated: 1/17/2024 9:33:19 PM; Lens Transparency: Clear; Lifecycle Status: Active; Minimum Order: 1; Mounting Type: Surface Mount; Package / Case: 0805 (2012 Metric); Packaging: TapeAndReel; PartId: 317; Part Status: Active; Price: 0.17; Series: -; Size / Dimension: 2.00mm L x 1.20mm W; Supplier 1: DigiKey; Supplier Part Number 1: 492-1350-1-ND; Supplier Device Package: 0805; Value: Red
D26 = SM0805UYC: LED YELLOW CLEAR 0805 SMD; Manufacturer: Bivar Inc.; Configuration: Standard; Current - Test: 20mA; Lens Color: Colorless; Lens Size: 1.40mm x 1.20mm; Lens Style: Rectangle with Flat Top; Millicandela Rating: 70mcd; Viewing Angle: 130°; Voltage - Forward (Vf) (Typ): 2.1V; Wavelength - Dominant: 592nm; Wavelength - Peak: 593nm; Part Number: SM0805UYC; Color: Yellow; ComponentLink1Description: Datasheet; ComponentLink1URL: https://www.bivar.com/Files/Datasheets/SM0805UYC.pdf; ComponentLink2Description: DigiKey Link; ComponentLink2URL: https://www.digikey.com/en/products/detail/bivar-inc/SM0805UYC/2408547; Device Package: 0805 (2012 Metric); Height (Max): 0.80mm; LastUpdated: 1/17/2024 9:34:39 PM; Lens Transparency: Clear; Lifecycle Status: Active; Minimum Order: 1; Mounting Type: Surface Mount; Package / Case: 0805 (2012 Metric); Packaging: TapeAndReel; PartId: 64; Part Status: Active; Price: 0.17; Series: -; Size / Dimension: 2.00mm L x 1.20mm W; Supplier 1: DigiKey; Supplier Part Number 1: 492-1328-1-ND; Supplier Device Package: 0805; Value: Yellow
D27 = SM0805UGC: LED GREEN CLEAR 0805 SMD; Manufacturer: Bivar Inc.; Configuration: Standard; Current - Test: 20mA; Lens Color: Colorless; Lens Size: 1.40mm x 1.20mm; Lens Style: Rectangle with Flat Top; Millicandela Rating: 10mcd; Viewing Angle: 130°; Voltage - Forward (Vf) (Typ): 2V; Wavelength - Dominant: 565nm; Wavelength - Peak: 563nm; Part Number: SM0805UGC; Color: Green; ComponentLink1Description: Datasheet; ComponentLink1URL: https://www.bivar.com/Files/Datasheets/SM0805UGC.pdf; ComponentLink2Description: DigiKey Link; ComponentLink2URL: https://www.digikey.com/en/products/detail/bivar-inc/SM0805UGC/2408549; Device Package: 0805 (2012 Metric); Height (Max): 1.10mm; LastUpdated: 1/17/2024 9:33:43 PM; Lens Transparency: Clear; Lifecycle Status: Active; Minimum Order: 1; Mounting Type: Surface Mount; Package / Case: 0805 (2012 Metric); Packaging: TapeAndReel; PartId: 247; Part Status: Active; Price: 0.19; Series: -; Size / Dimension: 2.00mm L x 1.20mm W; Supplier 1: DigiKey; Supplier Part Number 1: 492-1329-1-ND; Supplier Device Package: 0805; Value: Green
D28 = SM0805UBWC: LED BLUE CLEAR 0805 SMD; Manufacturer: Bivar Inc.; Configuration: Standard; Current - Test: 20mA; Lens Color: Colorless; Lens Size: 1.40mm x 1.20mm; Lens Style: Rectangle with Flat Top; Millicandela Rating: 115mcd; Viewing Angle: 130°; Voltage - Forward (Vf) (Typ): 3.3V; Wavelength - Dominant: 470nm; Wavelength - Peak: 468nm; Part Number: SM0805UBWC; Color: Blue; ComponentLink1Description: Datasheet; ComponentLink1URL: https://www.bivar.com/Files/Datasheets/SM0805UBWC.pdf; ComponentLink2Description: DigiKey Link; ComponentLink2URL: https://www.digikey.com/en/products/detail/bivar-inc/SM0805UBWC/2408548; Device Package: 0805 (2012 Metric); Height (Max): 1.10mm; LastUpdated: 1/17/2024 9:31:18 PM; Lens Transparency: Clear; Lifecycle Status: Active; Minimum Order: 1; Mounting Type: Surface Mount; Package / Case: 0805 (2012 Metric); Packaging: TapeAndReel; PartId: 763; Part Status: Active; Price: 0.46; Series: -; Size / Dimension: 2.00mm L x 1.20mm W; Supplier 1: DigiKey; Supplier Part Number 1: 492-1330-1-ND; Supplier Device Package: 0805; Value: Blue
DS1 DS2 = CMP-44525-000002-1: DISPLAY 7-SEG 0.2" SGL RED 10SMD; Element Configuration: Common Cathode; Operating Supply Voltage: 1.95V; Wavelength: 630nm; Power Consumption: 75mW; Number of Characters: 1; Forward Current: 30mA; Test Current: 20mA; Luminous Intensity: 30mcd; Min Operating Temperature: -40°C; Package Quantity: 650; Height: 0.315inch; Packaging: Tape and Reel; Width: 0.272inch; Max Power Dissipation: 75mW; Color: Red; Illumination Color: Red; Lead Free: Lead Free; Case/Package: SMD/SMT; Max Operating Temperature: 85°C; Forward Voltage: 1.95V
R73 R75 = RAVF168DJT220R: RES ARRAY 8 RES 220 OHM 1506; Manufacturer: Stackpole Electronics Inc; Circuit Type: Isolated; Number of Resistors: 8; Power Per Element: 62.5mW; Resistance (Ohms): 220; Temperature Coefficient: ±200ppm/°C; Tolerance: ±5%; Part Number: RAVF168DJT220R; ComponentLink1Description: Datasheet; ComponentLink1URL: https://www.seielect.com/catalog/sei-ravf.pdf; ComponentLink2Description: DigiKey Link; ComponentLink2URL: https://www.digikey.com/en/products/detail/stackpole-electronics-inc/RAVF168DJT220R/6273027; Height - Seated (Max): 0.020" (0.50mm); LastUpdated: 2/1/2024 9:38:25 PM; Lifecycle Status: Active; Minimum Order: 1; Mounting Type: Surface Mount; Number of Pins: 16; Operating Temperature: -55°C ~ 155°C; Package / Case: 1506, Convex, Long Side Terminals; Packaging: TapeAndReel; PartId: 654; Part Status: Active; Price: 0.03; Series: RAVF; Size / Dimension: 0.157" L x 0.063" W (4.00mm x 1.60mm); Supplier 1: DigiKey; Supplier Part Number 1: 738-RAVF168DJT220RCT-ND
R74 = RAVF164DJT220R: RES ARRAY 4 RES 220 OHM 1206; Manufacturer: Stackpole Electronics Inc; Circuit Type: Isolated; Number of Resistors: 4; Power Per Element: 62.5mW; Resistance (Ohms): 220; Temperature Coefficient: ±200ppm/°C; Tolerance: ±5%; Part Number: RAVF164DJT220R; Applications: Automotive AEC-Q200; ComponentLink1Description: Datasheet; ComponentLink1URL: https://www.seielect.com/catalog/sei-ravf.pdf; ComponentLink2Description: DigiKey Link; ComponentLink2URL: http://digikey.com/product-detail/en/stackpole-electronics-inc/RAVF164DJT220R/RAVF164DJT220RCT-ND/2425248; Height - Seated (Max): 0.024" (0.60mm); LastUpdated: 9/2/2020 1:23:25 AM; Lifecycle Status: Active; Minimum Order: 1; Mounting Type: Surface Mount; Number of Pins: 8; Operating Temperature: -55°C ~ 155°C; Package / Case: 1206 (3216 Metric), Convex, Long Side Terminals; Packaging: TapeAndReel; PartId: 59; Part Status: Active; Price: 0.01; Series: RAVF; Size / Dimension: 0.126" L x 0.063" W (3.20mm x 1.60mm); Supplier 1: DigiKey; Supplier Part Number 1: RAVF164DJT220RCT-ND
U36 U37 = CMP-0388-00393-2: CMOS BCD-to-7-Segment LED Latch / Decoder / Driver, 3 to 18 V, -55 to 125 degC, 16-pin SOP (PW16), Green (RoHS & no Sb/Br); Manufacturer: Texas Instruments; SubFamily: Discrete Segment LED Driver; Vin(Max)(V): 18; Rating: Military; Vin(Min)(V): 3; ComponentLink2Description: Datasheet; DatasheetVersion: SCHS072B; ComponentLink3Description: Package Specification; PackageReference: PW0016A; ComponentLink2URL: http://www.ti.com/general/docs/lit/getliterature.tsp?genericPartNumber=CD4511B&fileType=pdf; PackageVersion: 4040064-4/G; ComponentLink3URL: http://www.ti.com/lit/ml/mpds361/mpds361.pdf; Eco-Plan: Green (RoHS & no Sb/Br); ComponentLink1Description: Manufacturer URL; Code_JEDEC: MO-153; ComponentLink1URL: http://www.ti.com/; PartNumber: CD4511BPWR; Mounting Technology: Surface Mount; PackageDescription: 16-Pin Plastic Small Outline, Body 4.40 x 5.00 mm, Pitch 0.65 mm

## Sheet Digital Inputs.SchDoc: Title
size A4; Project: Q24 VCU; ENG_APP_DATE: --/--/--; DSN_APP_DATE: --/--/--; CHK_APP_DATE: --/--/--; Date: *******; ApprovedBy: *******; CheckedBy: None; Author: *******; CompanyName: *******; DrawnBy: Jacob Chisholm; Engineer: *******; Organization: *******; Address1: *******; Address2: *******; Address3: *******; Address4: *******; DocumentNumber: 13; Revision: *******; SheetNumber: 13; SheetTotal: 14; Address_Website: https://jchisholm204.github.io; E-Mail: JacobChisholm1010@gmail.com; CurrentTime: *******; CurrentDate: *******; Time: *******; DocumentFullPathAndName: *******; DocumentName: *******; ModifiedDate: *******; ImagePath: *******; ProjectName: *******; Application_BuildNumber: *******
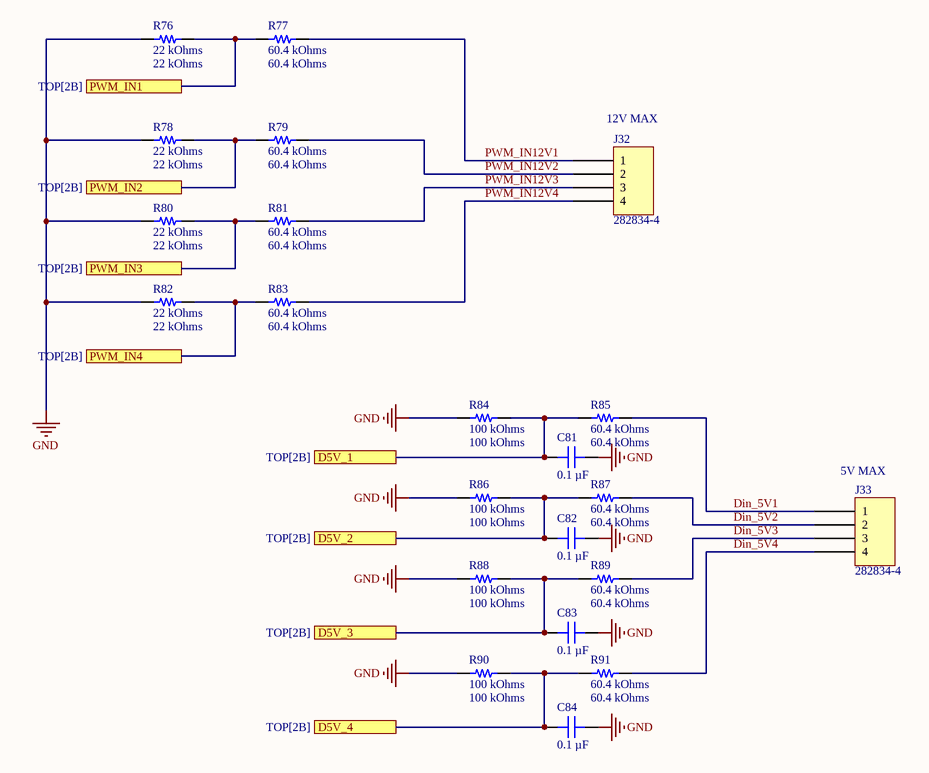
[diagram p12: Digital Inputs.SchDoc]

### Parts
C81  0.1 µF  [CAP 0603_1608]
C82  0.1 µF  [CAP 0603_1608]
C83  0.1 µF  [CAP 0603_1608]
C84  0.1 µF  [CAP 0603_1608]
J32  282834-4  [TE 282834-4]
J33  282834-4  [TE 282834-4]
R76  22 kOhms  [RES 0603_1608]
R77  60.4 kOhms  [RES 0603_1608]
R78  22 kOhms  [RES 0603_1608]
R79  60.4 kOhms  [RES 0603_1608]
R80  22 kOhms  [RES 0603_1608]
R81  60.4 kOhms  [RES 0603_1608]
R82  22 kOhms  [RES 0603_1608]
R83  60.4 kOhms  [RES 0603_1608]
R84  100 kOhms  [RES 0603_1608]
R85  60.4 kOhms  [RES 0603_1608]
R86  100 kOhms  [RES 0603_1608]
R87  60.4 kOhms  [RES 0603_1608]
R88  100 kOhms  [RES 0603_1608]
R89  60.4 kOhms  [RES 0603_1608]
R90  100 kOhms  [RES 0603_1608]
R91  60.4 kOhms  [RES 0603_1608]

### Ports
D5V_1 (see TOP[2B]), D5V_2 (see TOP[2B]), D5V_3 (see TOP[2B]), D5V_4 (see TOP[2B]), PWM_IN1 (see TOP[2B]), PWM_IN2 (see TOP[2B]), PWM_IN3 (see TOP[2B]), PWM_IN4 (see TOP[2B])

### Nets
GND: C81.2 C82.2 C83.2 C84.2 R76.2 R78.2 R80.2 R82.2 R84.1 R86.1 R88.1 R90.1
Din_1: C83.1 R88.2 R89.1 ; port D5V_3
Din_2: C82.1 R86.2 R87.1 ; port D5V_2
Din_3: C81.1 R84.2 R85.1 ; port D5V_1
Din_4: C84.1 R90.2 R91.1 ; port D5V_4
Din_5V1: J33.1 R85.2
Din_5V2: J33.2 R87.2
Din_5V3: J33.3 R89.2
Din_5V4: J33.4 R91.2
PWM_In1: R76.1 R77.2 ; port PWM_IN1
PWM_In2: R78.1 R79.2 ; port PWM_IN2
PWM_In3: R80.1 R81.2 ; port PWM_IN3
PWM_In4: R82.1 R83.2 ; port PWM_IN4
PWM_IN12V1: J32.1 R77.1
PWM_IN12V2: J32.2 R79.1
PWM_IN12V3: J32.3 R81.1
PWM_IN12V4: J32.4 R83.1

### Notes on the sheet
- (near J32) 12V MAX
- (near J33) 5V MAX
- Title:
- Drawn By:
- Page Contents:
- Checked By:
- Size:
- Date:
- File:
- License:
- Email:
- A4
- Number:
- Time:
- Revision:
- Sheet
- Website:
- of

### Library data of the parts
C81-C84 = 6R3X14W104MV4T: CAP CER 0.1UF 6.3V X7R 0603; manufacturer: Johanson Dielectrics Inc.; Tolerance: ±20%; Part Number: 6R3X14W104MV4T; Value: 0.1 µF; Applications: Bypass, Decoupling; Capacitance: 0.1 µF; componentlink1description: Datasheet; componentlink1url: https://www.johansondielectrics.com/downloads/x2y-filter-and-decoupling-capacitors.pdf; componentlink2description: DigiKey Link; componentlink2url: https://www.digikey.com/en/products/detail/johanson-dielectrics-inc/6R3X14W104MV4T/1556331; Device Package: 0603 (1608 Metric); Features: Low ESL (X2Y); lastupdated: 1/24/2024 8:09:44 PM; Lifecycle Status: Active; Minimum Order: 1; Mounting Type: Surface Mount, MLCC; Operating Temperature: -55°C ~ 125°C; Package / Case: 0603 (1608 Metric); packaging: TapeAndReel; partid: 2650; Part Status: Active; price: 0.08; series: X2Y®; Size / Dimension: 0.064" L x 0.035" W (1.63mm x 0.89mm); Supplier 1: DigiKey; Supplier Part Number 1: 709-1009-1-ND; Temperature Coefficient: X7R; Thickness (Max): 0.026" (0.66mm); Voltage - Rated: 6.3V
J32 J33 = 282834-4: TERM BLK 4P SIDE ENT 2.54MM PCB; Manufacturer: TE Connectivity AMP Connectors; Current: 10A; Mating Orientation: Horizontal with Board; Number of Levels: 1; Pitch: 0.100" (2.54mm); Positions Per Level: 4; Voltage: 150V; Wire Gauge: 16-30 AWG; Wire Termination: Screw - Rising Cage Clamp; Part Number: 282834-4; Color: Green; ComponentLink1Description: Datasheet; ComponentLink1URL: https://www.te.com/commerce/DocumentDelivery/DDEController?Action=srchrtrv&DocNm=282834&DocType=Customer+Drawing&DocLang=English; ComponentLink2Description: DigiKey Link; ComponentLink2URL: http://digikey.com/product-detail/en/te-connectivity-amp-connectors/282834-4/A98335-ND/1153265; LastUpdated: 1/15/2020 4:16:05 AM; Lifecycle Status: Active; Minimum Order: 1; Mounting Type: Through Hole; Packaging: Bulk; Part Status: Active; Price: 2.68; Series: Buchanan; Supplier 1: DigiKey; Supplier Part Number 1: A98335-ND
R76 R78 R80 R82 = AC0603FR-7W22KL: RES 22K OHM 1% 1/5W 0603; Part Number: AC0603FR-7W22KL; Value: 22 kOhms
R77 R79 R81 R83 R85 R87 R89 R91 = AC0603FR-0760K4L: RES SMD 60.4K OHM 1% 1/10W 0603; Part Number: AC0603FR-0760K4L; Value: 60.4 kOhms
R84 R86 R88 R90 = AA0603FR-07100KL: RES SMD 100K OHM 1% 1/10W 0603; Part Number: AA0603FR-07100KL; Value: 100 kOhms